# Altium schematic sheet _klt-kr7-ov7251.SchDoc
size Tabloid
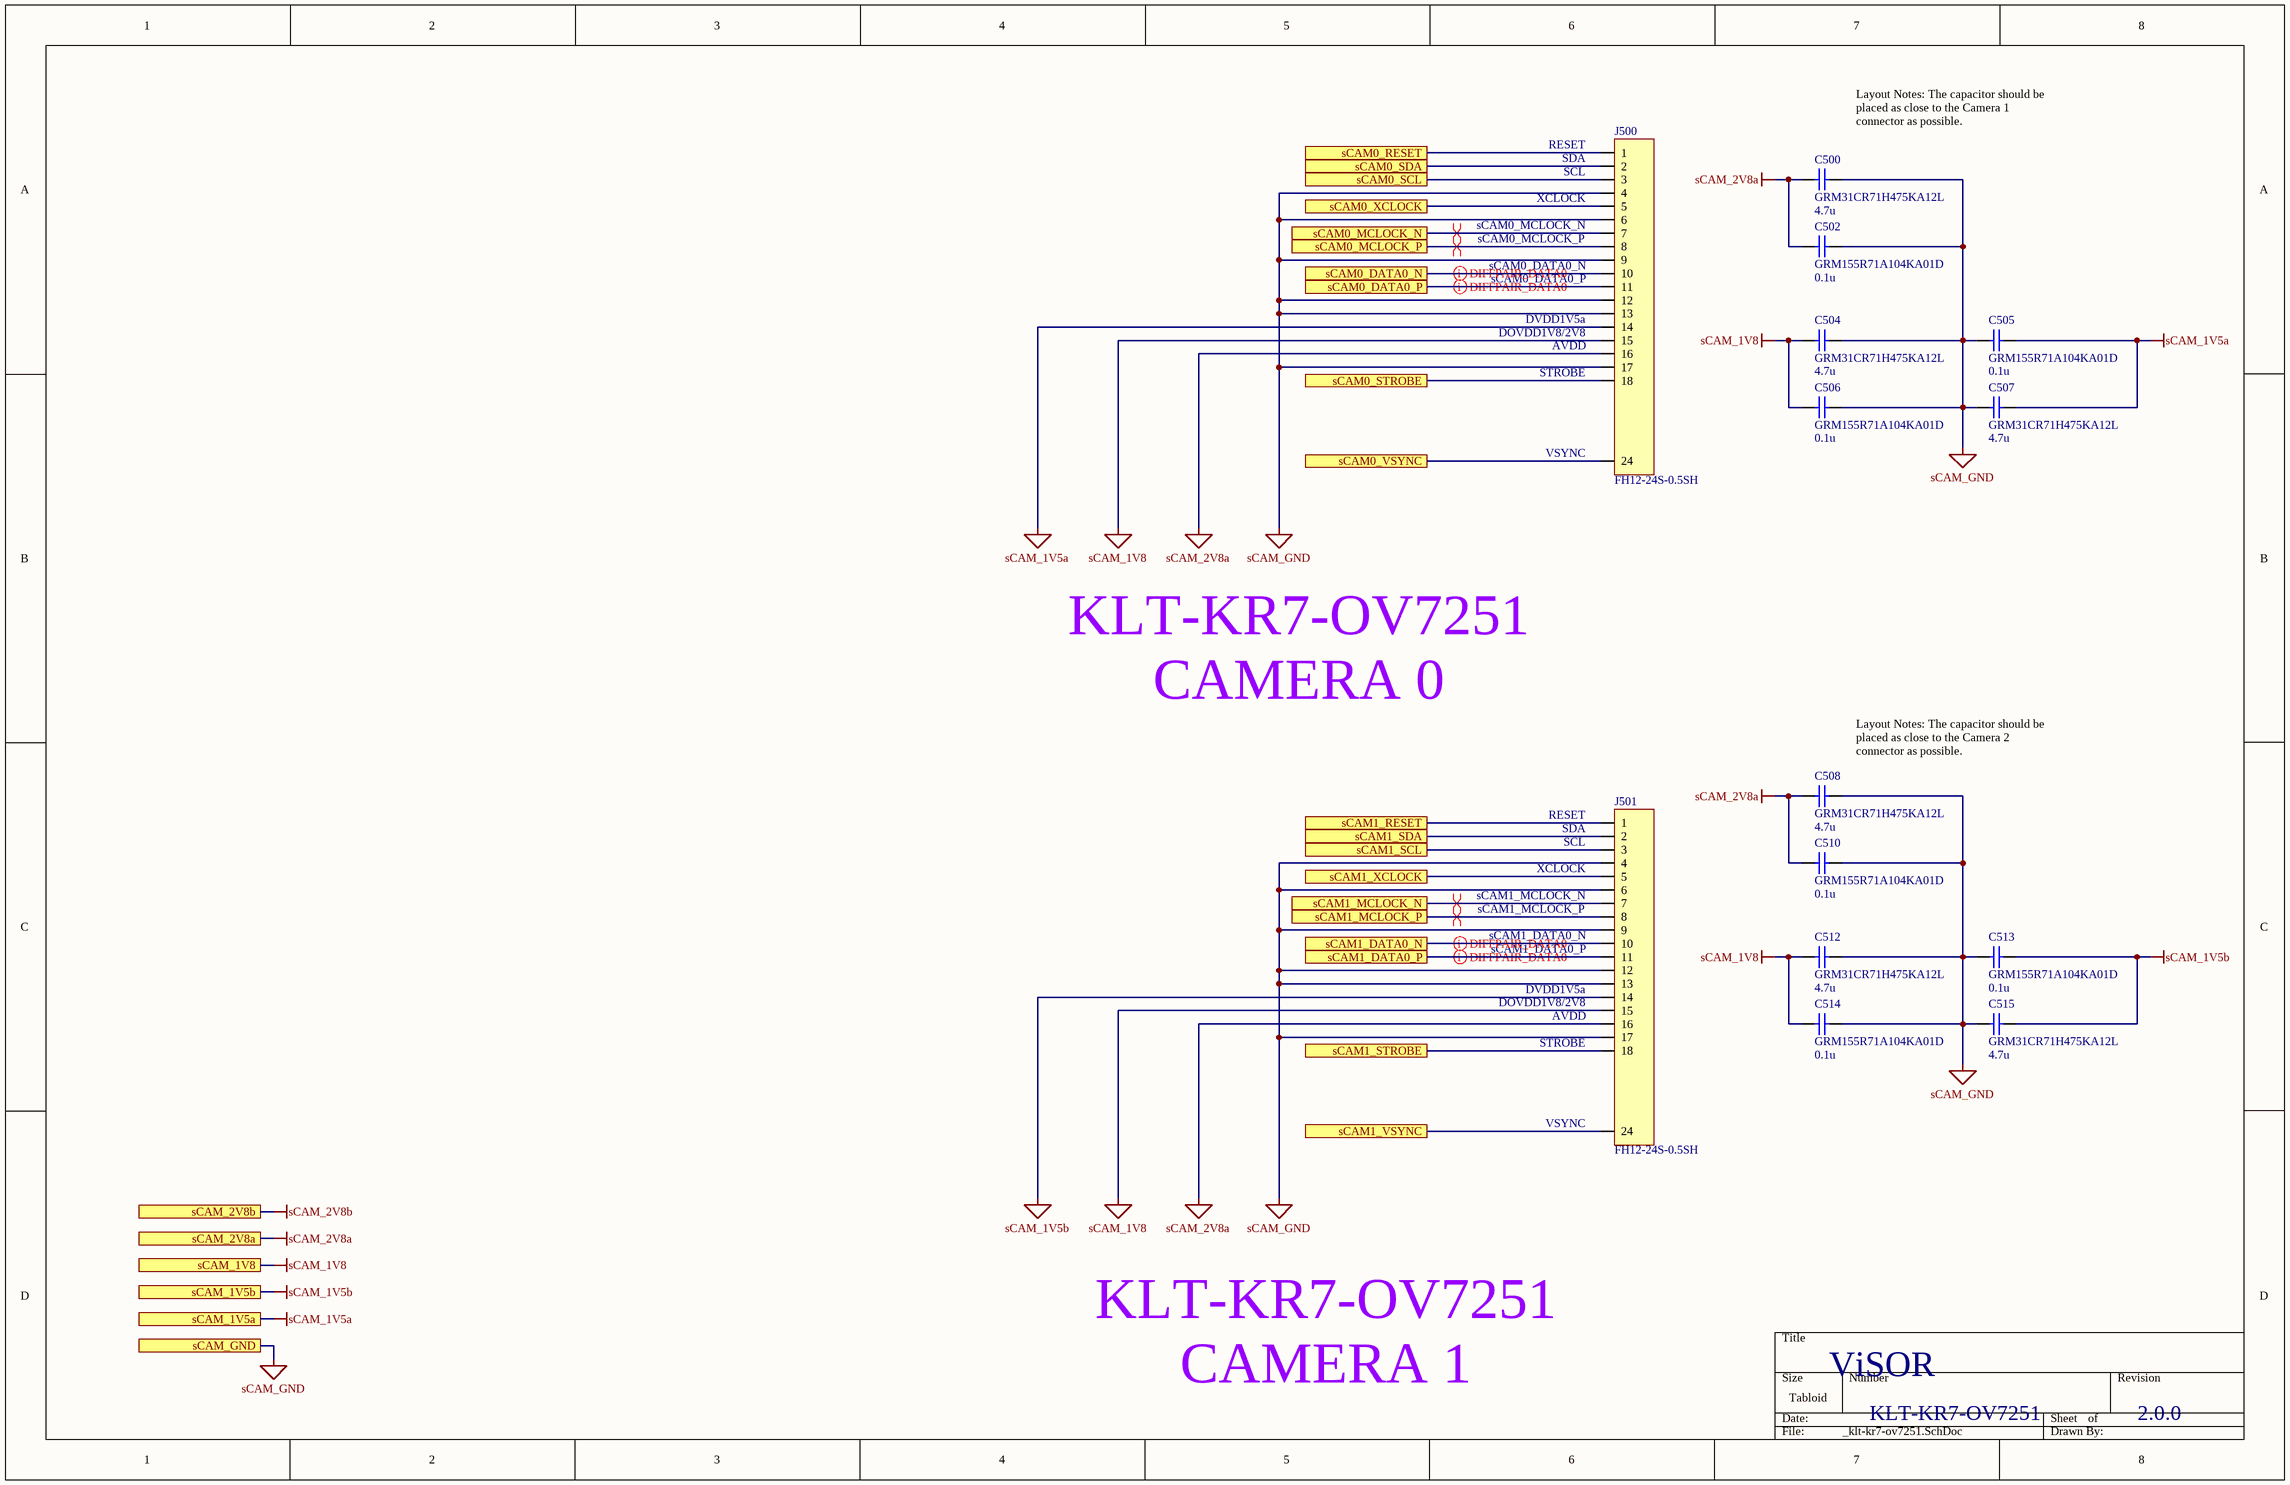
[diagram p0: _klt-kr7-ov7251.SchDoc]

## Parts
C500  GRM31CR71H475KA12L  value 4.7u  [1206]
C502  GRM155R71A104KA01D  value 0.1u  [0402]
C504  GRM31CR71H475KA12L  value 4.7u  [1206]
C505  GRM155R71A104KA01D  value 0.1u  [0402]
C506  GRM155R71A104KA01D  value 0.1u  [0402]
C507  GRM31CR71H475KA12L  value 4.7u  [1206]
C508  GRM31CR71H475KA12L  value 4.7u  [1206]
C510  GRM155R71A104KA01D  value 0.1u  [0402]
C512  GRM31CR71H475KA12L  value 4.7u  [1206]
C513  GRM155R71A104KA01D  value 0.1u  [0402]
C514  GRM155R71A104KA01D  value 0.1u  [0402]
C515  GRM31CR71H475KA12L  value 4.7u  [1206]
J500  FH12-24S-0.5SH  [FH12-24S-0.5SH]
J501  FH12-24S-0.5SH  [FH12-24S-0.5SH]

## Ports
sCAM0_DATA0_N, sCAM0_DATA0_P, sCAM0_MCLOCK_N, sCAM0_MCLOCK_P, sCAM0_RESET, sCAM0_SCL, sCAM0_SDA, sCAM0_STROBE, sCAM0_VSYNC, sCAM0_XCLOCK, sCAM1_DATA0_N, sCAM1_DATA0_P, sCAM1_MCLOCK_N, sCAM1_MCLOCK_P, sCAM1_RESET, sCAM1_SCL, sCAM1_SDA, sCAM1_STROBE, sCAM1_VSYNC, sCAM1_XCLOCK, sCAM_1V5a, sCAM_1V5b, sCAM_1V8, sCAM_2V8a, sCAM_2V8b, sCAM_GND

## Nets
sCAM_1V5a: C505.2 C507.1 J500.14 ; port sCAM_1V5a
sCAM_1V5b: C513.2 C515.1 J501.14 ; port sCAM_1V5b
sCAM_1V8: C504.1 C506.2 C512.1 C514.2 J500.15 J501.15 ; port sCAM_1V8
sCAM_2V8a: C500.1 C502.2 C508.1 C510.2 J500.16 J501.16 ; port sCAM_2V8a
sCAM_2V8b: port sCAM_2V8b
sCAM_GND: C500.2 C502.1 C504.2 C505.1 C506.1 C507.2 C508.2 C510.1 C512.2 C513.1 C514.1 C515.2 J500.4 J500.6 J500.9 J500.12 J500.13 J500.17 J501.4 J501.6 J501.9 J501.12 J501.13 J501.17 ; port sCAM_GND
sCAM0_DATA0_N: J500.10 ; port sCAM0_DATA0_N
sCAM0_DATA0_P: J500.11 ; port sCAM0_DATA0_P
sCAM0_MCLOCK_N: J500.7 ; port sCAM0_MCLOCK_N
sCAM0_MCLOCK_P: J500.8 ; port sCAM0_MCLOCK_P
sCAM0_RESET: J500.1 ; port sCAM0_RESET
sCAM0_SCL: J500.3 ; port sCAM0_SCL
sCAM0_SDA: J500.2 ; port sCAM0_SDA
sCAM0_STROBE: J500.18 ; port sCAM0_STROBE
sCAM0_VSYNC: J500.24 ; port sCAM0_VSYNC
sCAM0_XCLOCK: J500.5 ; port sCAM0_XCLOCK
sCAM1_DATA0_N: J501.10 ; port sCAM1_DATA0_N
sCAM1_DATA0_P: J501.11 ; port sCAM1_DATA0_P
sCAM1_MCLOCK_N: J501.7 ; port sCAM1_MCLOCK_N
sCAM1_MCLOCK_P: J501.8 ; port sCAM1_MCLOCK_P
sCAM1_RESET: J501.1 ; port sCAM1_RESET
sCAM1_SCL: J501.3 ; port sCAM1_SCL
sCAM1_SDA: J501.2 ; port sCAM1_SDA
sCAM1_STROBE: J501.18 ; port sCAM1_STROBE
sCAM1_VSYNC: J501.24 ; port sCAM1_VSYNC
sCAM1_XCLOCK: J501.5 ; port sCAM1_XCLOCK

Not connected (* = marked no-connect by the designer): J500 19 20 21 22 23; J501 19 20 21 22 23

## Layout directives
differential pair: sCAM0_DATA0_N, sCAM0_DATA0_P, sCAM0_MCLOCK_N, sCAM0_MCLOCK_P, sCAM1_DATA0_N, sCAM1_DATA0_P, sCAM1_MCLOCK_N, sCAM1_MCLOCK_P

## Notes on the sheet
- (near J500) SDA
- (near J500) RESET
- Layout Notes: The capacitor should be placed as close to the Camera 1 connector as possible.
- (near J500) SCL
- (near J500) XCLOCK
- (near J500) AVDD
- (near J500) DVDD1V5a
- (near J500) DOVDD1V8/2V8
- (near J500) STROBE
- (near J500) VSYNC
- KLT-KR7-OV7251
  CAMERA 0
- (near C508) Layout Notes: The capacitor should be placed as close to the Camera 2 connector as possible.
- (near J501) SDA
- (near J501) RESET
- (near J501) SCL
- (near J501) XCLOCK
- (near J501) AVDD
- (near J501) DVDD1V5a
- (near J501) DOVDD1V8/2V8
- (near J501) STROBE
- (near J501) VSYNC
- KLT-KR7-OV7251
  CAMERA 1
- ViSOR
- KLT-KR7-OV7251
- 2.0.0

## Library data of the parts
C500 C504 C507 C508 C512 C515 = GRM31CR71HxxxKdddd: -55-125C, 3216, 50V, X7R, ±10%
C502 C505 C506 C510 C513 C514 = GRM155R71AxxxKdddd: -55-125C, 1005, 10V, X7R, ±10%
J500 J501 = FH12-24S-0.5SH: ONN FFC BOTTOM 24POS 0.50MM R/A